# Altium project LPGDetA1.PrjPCB (part 1 of 2)
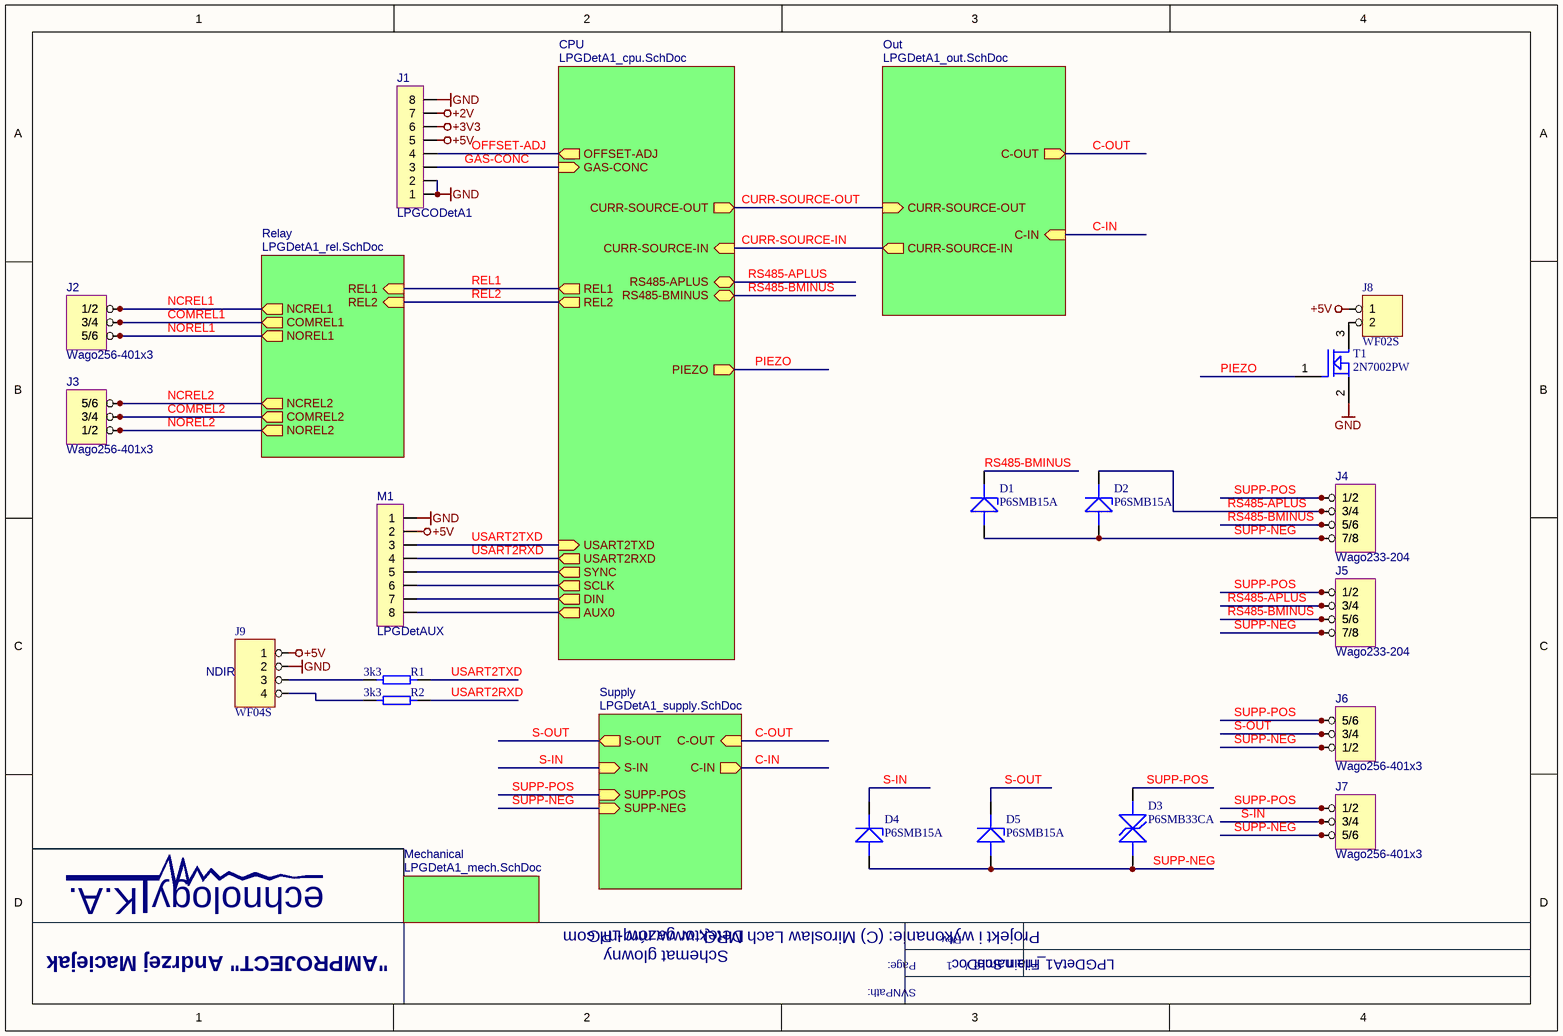
[diagram p0: LPGDetA1_main.SchDoc]
Nazwa_projektu: Detektor gazów LPG
6 sheets, 165 parts. Net scope: hierarchical (ports join the sheet entries above them; power ports are global).
Board files: LPGDetA1.PcbDoc, LPGDetA1_F.PcbDoc
Sheets:
  LPGDetA1_main.SchDoc
    CPU = LPGDetA1_cpu.SchDoc
    Supply = LPGDetA1_supply.SchDoc
    Out = LPGDetA1_out.SchDoc
    Mechanical = LPGDetA1_mech.SchDoc
    Relay = LPGDetA1_rel.SchDoc

## Sheet LPGDetA1_main.SchDoc
size A4; DocumentNumber: 1; SheetNumber: 1; SheetTotal: 6; Subtitle0: Schemat glowny; LotOfPieces: 1

### Parts
(Parts that share a designator on the sheet are numbered #1, #2 ... from top to bottom, then left to right.)
?#1  (no value)
D1  P6SMB15A  [SMB]
D2  P6SMB15A  [SMB]
D3  P6SMB33CA  [DO-214AA]
D4  P6SMB15A  [SMB]
D5  P6SMB15A  [SMB]
J1  LPGCODetA1  [LPGCODetA1]
J2  Wago256-401x3  [WAGO256-401x3]
J3  Wago256-401x3  [WAGO256-401x3]
J4  Wago233-204  [Wago233-204]
J5  Wago233-204  [Wago233-204]
J6  Wago256-401x3  [WAGO256-401x3]
J7  Wago256-401x3  [WAGO256-401x3]
J8  WF02S  [WF02S]
J9  WF04S  [WF04S]
M1  LPGDetAUX  [LPGDETAUX]
R1  OtherParams: 3k3  [0805]  (hidden comment: 0805WAJ 3K3 T5E)
R2  OtherParams: 3k3  [0805]  (hidden comment: 0805WAJ 3K3 T5E)
T1  2N7002PW  [SOT323-3_FLOW]

### Sub-sheets
CPU = LPGDetA1_cpu.SchDoc: OFFSET-ADJ, GAS-CONC, CURR-SOURCE-OUT, CURR-SOURCE-IN, RS485-APLUS, RS485-BMINUS, REL1, REL2, USART2TXD, USART2RXD, SYNC, SCLK, DIN, AUX0, PIEZO
Mechanical = LPGDetA1_mech.SchDoc: no entries
Out = LPGDetA1_out.SchDoc: CURR-SOURCE-OUT, C-OUT, C-IN, CURR-SOURCE-IN
Relay = LPGDetA1_rel.SchDoc: REL1, REL2, COMREL1, COMREL2, NOREL1, NOREL2, NCREL1, NCREL2
Supply = LPGDetA1_supply.SchDoc: SUPP-POS, SUPP-NEG, S-OUT, S-IN, C-IN, C-OUT

### Nets
+2V: J1.7
+3V3: J1.6
+5V: J1.5 J8.1 J9.1 M1.2
GND: J1.1 J1.2 J1.8 J9.2 M1.1 T1.2(SOURCE)
AUX0: M1.8 ; sheet CPU/AUX0
C-IN: sheet Supply/C-IN, sheet Out/C-IN
C-OUT: sheet Supply/C-OUT, sheet Out/C-OUT
COMREL1: J2.3(3/4) J2.4(3/4) ; sheet Relay/COMREL1
COMREL2: J3.3(3/4) J3.4(3/4) ; sheet Relay/COMREL2
CURR-SOURCE-IN: sheet CPU/CURR-SOURCE-IN, sheet Out/CURR-SOURCE-IN
CURR-SOURCE-OUT: sheet CPU/CURR-SOURCE-OUT, sheet Out/CURR-SOURCE-OUT
DIN: M1.7 ; sheet CPU/DIN
GAS-CONC: J1.3 ; sheet CPU/GAS-CONC
NCREL1: J2.1(1/2) J2.2(1/2) ; sheet Relay/NCREL1
NCREL2: J3.5(5/6) J3.6(5/6) ; sheet Relay/NCREL2
NOREL1: J2.5(5/6) J2.6(5/6) ; sheet Relay/NOREL1
NOREL2: J3.1(1/2) J3.2(1/2) ; sheet Relay/NOREL2
OFFSET-ADJ: J1.4 ; sheet CPU/OFFSET-ADJ
PIEZO: T1.1(GATE) ; sheet CPU/PIEZO
REL1: sheet CPU/REL1, sheet Relay/REL1
REL2: sheet CPU/REL2, sheet Relay/REL2
RS485-APLUS: D2.CATH J4.3(3/4) J4.4(3/4) J5.3(3/4) J5.4(3/4) ; sheet CPU/RS485-APLUS
RS485-BMINUS: D1.CATH J4.5(5/6) J4.6(5/6) J5.5(5/6) J5.6(5/6) ; sheet CPU/RS485-BMINUS
S-IN: D4.CATH J7.3(3/4) J7.4(3/4) ; sheet Supply/S-IN
S-OUT: D5.CATH J6.3(3/4) J6.4(3/4) ; sheet Supply/S-OUT
SCLK: M1.6 ; sheet CPU/SCLK
SUPP-NEG: D1.ANOD D2.ANOD D3.ANOD D4.ANOD D5.ANOD J4.7(7/8) J4.8(7/8) J5.7(7/8) J5.8(7/8) J6.1(1/2) J6.2(1/2) J7.5(5/6) J7.6(5/6) ; sheet Supply/SUPP-NEG
SUPP-POS: D3.CATH J4.1(1/2) J4.2(1/2) J5.1(1/2) J5.2(1/2) J6.5(5/6) J6.6(5/6) J7.1(1/2) J7.2(1/2) ; sheet Supply/SUPP-POS
SYNC: M1.5 ; sheet CPU/SYNC
USART2RXD: M1.4 R2.2 ; sheet CPU/USART2RXD
USART2TXD: M1.3 R1.2 ; sheet CPU/USART2TXD
NetJ8_2: J8.2 T1.3(DRAIN)
NetJ9_3: J9.3 R1.1
NetJ9_4: J9.4 R2.1

### Notes on the sheet
- (near J9) NDIR
- K.A.
- echnology
- Projekt i wykonanie: (C) Miroslaw Lach MRQ, www.mrq-ml.com
- "AMPROJECT" Andrzej Maciejak
- SVNPath:
- Page:
- Rev.
- /
- File name:

### Library data of the parts
?#1 = KATECHNOLOGYLOGO
D1 D2 D4 D5 = P6SMB15A[[/\]]SMB: Descript: Transient Suppresion Unidirectional Diode 15V 600W, case SMB; Reference5: P6SMB15A-LF; Currency5: PLZ; Amount5: 3+; Value: P6SMB15A; Dimensions: SMB; ComponentLink1Description: Datasheet; ComponentLink1URL: http://www.mrq-ml.com/Parts/Diodes/Littelfuse_TVS-Diodes_P6SMB.pdf; Supplier5: tme.pl; Manufacturer5: Littelfuse; Typ5: P6SMB15A; Price5: 0,7; DateOfPrice5: 2012-09-30; Price1: 0,48
D3 = P6SMB33CA[[/\]]SMB: Descript: Transient Suppresion Bidirectional Diode 40.7V 600W, case SMB; Currency5: PLN; Amount5: 3+; Value: P6SMB33CA; Dimensions: SMB; ComponentLink1Description: Datasheet; ComponentLink1URL: http://www.mrq-ml.com/Parts/Diodes/Littelfuse_TVS-Diodes_P6SMB.pdf; Supplier5: tme.pl; Reference5: P6SMB33CA; Manufacturer5: Semikron; Typ5: P6SMB33CA; Price5: 0,7; DateOfPrice5: 2012-11-24; Price1: 0,389
J1 = LPGCODetA1[[/\]]LPGCODetA1: Descript: Modul czujnika CO/LPG; Reference5: mlach; Value: LPGCODetA1; Dimensions: LPGCODetA1; Supplier5: modu³ LPGCODetA1
J2 J3 J6 J7 = Wago256-401x3[[/\]]15x15: Descript: z彻czka do p硑tek drukowanych 45� 2,5mm2 16A RM5 1P/2pin szary, 3 tory plus scianka; Reference5: 256-401 (3szt.) +256-100(1szt.); Typ5: 256-401x3, 256-100; Currency5: PLN; Amount5: 10+; Value: Wago256-401x3; Dimensions: 15x15; Supplier5: soselectronic.pl; Manufacturer5: Wago; Price5: 2,8278; DateOfPrice5: 2012-11-24; Price1: 2,3056
J4 J5 = Wago233-204[[/\]]13.9x12.3: Descript: PCB terminal strip with push buttons 0.5mm2; Currency5: PLN; Amount5: 2+; Value: Wago233-204; Dimensions: 13.9x12.3; ComponentLink1Description: Datasheet; ComponentLink1URL: http://www.mrq-ml.com/Parts/Connectors/Wago233-204.pdf; Supplier5: soselectronic.pl; Reference5: 233-204; Manufacturer5: Wago; Typ5: 233-204; Price5: 4,078; DateOfPrice5: 2012-11-24; Price1: 3,2542
J8 = WF02S[[/\]]WF02S: Descript: connector 2,54 pitch, SMD, 2 pole, straight, male; Reference5: WF02S-LF; Currency5: PLZ; Amount5: 10+; Value: WF02S; Dimensions: WF02S; ComponentLink1Description: Datasheet; ComponentLink1URL: http://www.mrq-ml.com/Parts/Connectors/WFXXS.pdf; Supplier5: maritex.com.pl; Price5: 0,029; DateOfPrice5: 2012-09-18
J9 = WF04S[[/\]]WF04S: Descript: connector 2.54mm pitch, THT, 4 pole, straight, male; Reference5: WF04S-JS; Currency5: PLN; Amount5: 10+; Value: WF04S; Dimensions: WF04S; ComponentLink1Description: Datasheet; ComponentLink1URL: http://www.mrq-ml.com/Parts/Connectors/WFXXS.pdf; Supplier5: maritex.com.pl; Price5: 0,069; DateOfPrice5: 2012-07-11
M1 = LPGDetAUX[[/\]]LPGDetAUX: Descript: Dodatkowy modul do LPGDet; Value: LPGDetAUX; Dimensions: LPGDetAUX
R1 R2 = 0805WAJ 3K3 T5E[[/\]]0805[[/\]]0.125W[[/\]]5%[[/\]]3k3: DissPower: 0.125W; Tolerance: 5%; Descript: Resistor 3.3kohm, 0.125W, 5%, 0805; Reference5: SMD0805-3K3; Currency5: PLN; Amount5: 100+; Value: 0805WAJ 3K3 T5E; Dimensions: 0805; ComponentLink1Description: Datasheet; ComponentLink1URL: http://www.mrq-ml.com/Parts/Resistors/RoyalOhm_rezystor-smd.pdf; Supplier5: tme.pl; Manufacturer5: Royal Ohm; Typ5: 0805WAJ 3K3 T5E; Price5: 0,025; DateOfPrice5: 2012-09-18
T1 = 2N7002PW[[/\]]SOT323-3: Descript: N-channel enhacement-mode vertical DMOS FET; Reference5: 1829184; Currency5: PLN; Amount5: 1+; Value: 2N7002PW; Dimensions: SOT323-3; ComponentLink1Description: Datasheet; ComponentLink1URL: http://www.mrq-ml.com/Parts/Transistors/2N7002PW.pdf; Supplier5: farnell.com; Manufacturer5: NXP; Typ5: 2N7002PW; Price5: 0,17; DateOfPrice5: 2012-09-19; Price1: 0,14

## Sheet LPGDetA1_cpu.SchDoc
size A4; DocumentNumber: 3; SheetNumber: 3; SheetTotal: 6; Subtitle0: Mikrokontoler; LotOfPieces: 1; SVNPath: SVNPath
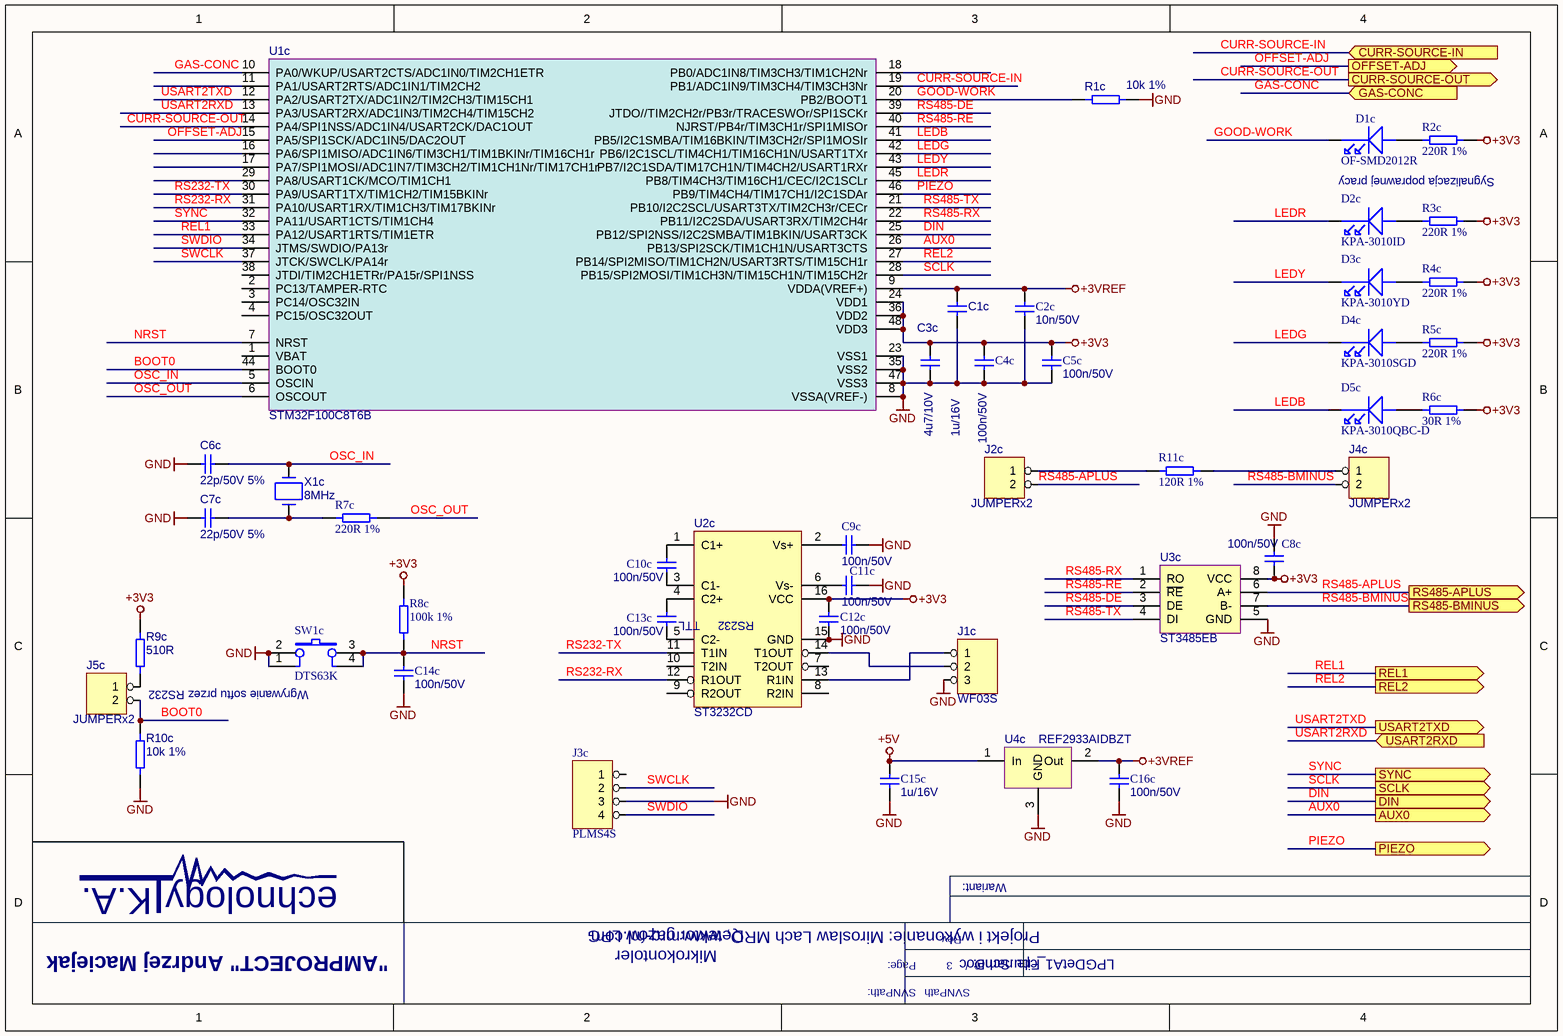
[diagram p1: LPGDetA1_cpu.SchDoc]

### Parts
(Parts that share a designator on the sheet are numbered #1, #2 ... from top to bottom, then left to right.)
?#2  (no value)
C1c  OtherParams: 1u/16V  [1206_0805]  (hidden comment: C0805C105K4RAC)
C2c  OtherParams: 10n/50V  [1206_0805]  (hidden comment: CL21B103KBANNNC)
C3c  OtherParams: 4u7/10V  [1206-IPC]  (hidden comment: CL31B475KPHNNNE)
C4c  OtherParams: 100n/50V  [1206_0805]  (hidden comment: CL21B104KBCNNNC)
C5c  OtherParams: 100n/50V  [1206_0805]  (hidden comment: CL21B104KBCNNNC)
C6c  OtherParams: 22p/50V 5%  [0805]  (hidden comment: CL21C220JBANNNC)
C7c  OtherParams: 22p/50V 5%  [0805]  (hidden comment: CL21C220JBANNNC)
C8c  OtherParams: 100n/50V  [1206_0805]  (hidden comment: CL21B104KBCNNNC)
C9c  OtherParams: 100n/50V  [1206_0805]  (hidden comment: CL21B104KBCNNNC)
C10c  OtherParams: 100n/50V  [1206_0805]  (hidden comment: CL21B104KBCNNNC)
C11c  OtherParams: 100n/50V  [1206_0805]  (hidden comment: CL21B104KBCNNNC)
C12c  OtherParams: 100n/50V  [1206_0805]  (hidden comment: CL21B104KBCNNNC)
C13c  OtherParams: 100n/50V  [1206_0805]  (hidden comment: CL21B104KBCNNNC)
C14c  OtherParams: 100n/50V  [1206_0805]  (hidden comment: CL21B104KBCNNNC)
C15c  OtherParams: 1u/16V  [1206_0805]  (hidden comment: C0805C105K4RAC)
C16c  OtherParams: 100n/50V  [1206_0805]  (hidden comment: CL21B104KBCNNNC)
D1c  OF-SMD2012R  [D0805]
D2c  KPA-3010ID  [KPA-3010SURCK]
D3c  KPA-3010YD  [KPA-3010SYCK]
D4c  KPA-3010SGD  [KPA-3010CGCK]
D5c  KPA-3010QBC-D  [KPA-3010QBC-D]
J1c  WF03S  [WF03S]
J2c  JUMPERx2  [2SIP100]
J3c  PLMS4S  [PLMS4S]
J4c  JUMPERx2  [2SIP100]
J5c  JUMPERx2  [2SIP100]
R1c  OtherParams: 10k 1%  [0805]  (hidden comment: 0805WAF10KT5E)
R2c  OtherParams: 220R 1%  [0805]  (hidden comment: 0805WAF 220R T5E)
R3c  OtherParams: 220R 1%  [0805]  (hidden comment: 0805WAF 220R T5E)
R4c  OtherParams: 220R 1%  [0805]  (hidden comment: 0805WAF 220R T5E)
R5c  OtherParams: 220R 1%  [0805]  (hidden comment: 0805WAF 220R T5E)
R6c  OtherParams: 30R 1%  [0805]  (hidden comment: 0805WAF 30R T5E)
R7c  OtherParams: 220R 1%  [0805]  (hidden comment: 0805WAF 220R T5E)
R8c  OtherParams: 100k 1%  [0805]  (hidden comment: 0805WAF 100K T5E)
R9c  OtherParams: 510R  [0805]  (hidden comment: 0805WAJ 510R T5E)
R10c  OtherParams: 10k 1%  [0805]  (hidden comment: 0805WAF10KT5E)
R11c  OtherParams: 120R 1%  [1206_0805]  (hidden comment: 0805WAF 120R T5E)
SW1c  DTS63K  [DTS63K]
U1c  STM32F100C8T6B  [MS-026ABC]
U2c  ST3232CD  [16SOIC150]
U3c  ST3485EB  [8SOIC150]
U4c  REF2933AIDBZT  [SOT23-3]
X1c  8MHz  [HXC-7SB]

### Ports
AUX0, CURR-SOURCE-IN, CURR-SOURCE-OUT, DIN, GAS-CONC, OFFSET-ADJ, PIEZO, REL1, REL2, RS485-APLUS, RS485-BMINUS, SCLK, SYNC, USART2RXD, USART2TXD

### Nets
+3V3: C3c.1 C4c.1 C5c.1 C8c.2 C12c.1 R2c.2 R3c.2 R4c.2 R5c.2 R6c.2 R8c.1 R9c.1 U1c.24(VDD1) U1c.36(VDD2) U1c.48(VDD3) U2c.16(VCC) U3c.8(VCC)
+3VREF: C1c.1 C2c.1 C16c.1 U1c.9(VDDA(VREF+)) U4c.2(Out)
+5V: C15c.1 U4c.1(In)
GND: C1c.2 C2c.2 C3c.2 C4c.2 C5c.2 C6c.1 C7c.1 C8c.1 C9c.2 C11c.2 C12c.2 C14c.2 C15c.2 C16c.2 J1c.3 J3c.3 R1c.2 R10c.1 SW1c.1 SW1c.2 U1c.8(VSSA(VREF-)) U1c.23(VSS1) U1c.35(VSS2) U1c.47(VSS3) U2c.15(GND) U3c.5(GND) U4c.3(GND)
AUX0: U1c.26(PB13/SPI2SCK/TIM1CH1N/USART3CTS) ; port AUX0
BOOT0: J5c.2 R10c.2 U1c.44(BOOT0)
CURR-SOURCE-IN: U1c.19(PB1/ADC1IN9/TIM3CH4/TIM3CH3Nr) ; port CURR-SOURCE-IN
CURR-SOURCE-OUT: U1c.14(PA4/SPI1NSS/ADC1IN4/USART2CK/DAC1OUT) ; port CURR-SOURCE-OUT
DIN: U1c.25(PB12/SPI2NSS/I2C2SMBA/TIM1BKIN/USART3CK) ; port DIN
GAS-CONC: U1c.10(PA0/WKUP/USART2CTS/ADC1IN0/TIM2CH1ETR) ; port GAS-CONC
GOOD-WORK: D1c.CATH R1c.1 U1c.20(PB2/BOOT1)
LEDB: D5c.CATH U1c.41(PB5/I2C1SMBA/TIM16BKIN/TIM3CH2r/SPI1MOSIr)
LEDG: D4c.CATH U1c.42(PB6/I2C1SCL/TIM4CH1/TIM16CH1N/USART1TXr)
LEDR: D2c.CATH U1c.45(PB8/TIM4CH3/TIM16CH1/CEC/I2C1SCLr)
LEDY: D3c.CATH U1c.43(PB7/I2C1SDA/TIM17CH1N/TIM4CH2/USART1RXr)
NRST: C14c.1 R8c.2 SW1c.3 SW1c.4 U1c.7(NRST)
OFFSET-ADJ: U1c.15(PA5/SPI1SCK/ADC1IN5/DAC2OUT) ; port OFFSET-ADJ
OSC_IN: C6c.2 U1c.5(OSCIN) X1c.1
OSC_OUT: R7c.2 U1c.6(OSCOUT)
PIEZO: U1c.46(PB9/TIM4CH4/TIM17CH1/I2C1SDAr) ; port PIEZO
REL1: U1c.33(PA12/USART1RTS/TIM1ETR) ; port REL1
REL2: U1c.27(PB14/SPI2MISO/TIM1CH2N/USART3RTS/TIM15CH1r) ; port REL2
RS232-RX: U1c.31(PA10/USART1RX/TIM1CH3/TIM17BKINr) U2c.12(R1OUT)
RS232-TX: U1c.30(PA9/USART1TX/TIM1CH2/TIM15BKINr) U2c.11(T1IN)
RS485-APLUS: J2c.2 U3c.6(A+) ; port RS485-APLUS
RS485-BMINUS: J4c.2 U3c.7(B-) ; port RS485-BMINUS
RS485-DE: U1c.39(JTDO//TIM2CH2r/PB3r/TRACESWOr/SPI1SCKr) U3c.3(DE)
RS485-RE: U1c.40(NJRST/PB4r/TIM3CH1r/SPI1MISOr) U3c.2(~{RE})
RS485-RX: U1c.22(PB11/I2C2SDA/USART3RX/TIM2CH4r) U3c.1(RO)
RS485-TX: U1c.21(PB10/I2C2SCL/USART3TX/TIM2CH3r/CECr) U3c.4(DI)
SCLK: U1c.28(PB15/SPI2MOSI/TIM1CH3N/TIM15CH1N/TIM15CH2r) ; port SCLK
SWCLK: J3c.2 U1c.37(JTCK/SWCLK/PA14r)
SWDIO: J3c.4 U1c.34(JTMS/SWDIO/PA13r)
SYNC: U1c.32(PA11/USART1CTS/TIM1CH4) ; port SYNC
USART2RXD: U1c.13(PA3/USART2RX/ADC1IN3/TIM2CH4/TIM15CH2) ; port USART2RXD
USART2TXD: U1c.12(PA2/USART2TX/ADC1IN2/TIM2CH3/TIM15CH1) ; port USART2TXD
NetC7c_2: C7c.2 R7c.1 X1c.2
NetC9c_1: C9c.1 U2c.2(Vs+)
NetC10c_1: C10c.1 U2c.1(C1+)
NetC10c_2: C10c.2 U2c.3(C1-)
NetC11c_1: C11c.1 U2c.6(Vs-)
NetC13c_1: C13c.1 U2c.4(C2+)
NetC13c_2: C13c.2 U2c.5(C2-)
NetD1c_ANOD: D1c.ANOD R2c.1
NetD2c_ANOD: D2c.ANOD R3c.1
NetD3c_ANOD: D3c.ANOD R4c.1
NetD4c_ANOD: D4c.ANOD R5c.1
NetD5c_ANOD: D5c.ANOD R6c.1
NetJ1c_1: J1c.1 U2c.13(R1IN)
NetJ1c_2: J1c.2 U2c.14(T1OUT)
NetJ2c_1: J2c.1 R11c.1
NetJ4c_1: J4c.1 R11c.2
NetJ5c_1: J5c.1 R9c.2

Not connected (* = marked no-connect by the designer): J3c 1; U1c 1(VBAT) 2(PC13/TAMPER-RTC) 3(PC14/OSC32IN) 4(PC15/OSC32OUT) 11(PA1/USART2RTS/ADC1IN1/TIM2CH2) 16(PA6/SPI1MISO/ADC1IN6/TIM3CH1/TIM1BKINr/TIM16CH1r) 17(PA7/SPI1MOSI/ADC1IN7/TIM3CH2/TIM1CH1Nr/TIM17CH1r) 18(PB0/ADC1IN8/TIM3CH3/TIM1CH2Nr) 29(PA8/USART1CK/MCO/TIM1CH1) 38(JTDI/TIM2CH1ETRr/PA15r/SPI1NSS); U2c 7(T2OUT) 8(R2IN) 9(R2OUT) 10(T2IN)

### Notes on the sheet
- Sygnalizacja poprawnej pracy
- Wgrywanie softu przez RS232
- K.A.
- echnology
- Wariant:
- Projekt i wykonanie: Miroslaw Lach MRQ, www.mrq-ml.com
- "AMPROJECT" Andrzej Maciejak
- SVNPath:
- Page:
- Rev.
- /
- File name:
- (in symbol ST3232CD[[/\]]16SOIC150) TTL; RS232

### Library data of the parts
?#2 = KATECHNOLOGYLOGO
C1c = C0805C105K4RAC[[/\]]0805[[/\]]16V[[/\]]10%[[/\]]1u/16V: Manufacturer1: KEMET; MaxVoltage: 16V; Tolerance: 10%; Tmin: -55; Tmax: +125; Descript: capacitor 1uF, 16V, 0805, 10%, X7R; Currency1: PLZ; Amount1: 10000+; Currency5: PLN; Amount5: 100+; Value: C0805C105K4RAC; Supplier1: tme.pl; Reference1: C0805C105K4RAC; Price1: 0,099; Typ1: C0805C105K4RAC; Dimensions: 0805; ComponentLink1Description: Datasheet; ComponentLink1URL: http://www.mrq-ml.com/Parts/Capacitors/ceramic_chip_kemet.pdf; DateOfPrice1: 2010-03-06; Supplier5: tme.pl; Reference5: C0805C105K4RAC; Manufacturer5: KEMET; Typ5: C0805C105K4RAC; Price5: 0,099; DateOfPrice5: 2013-01-03
C2c = CL21B103KBANNNC[[/\]]0805[[/\]]50V[[/\]]10%[[/\]]10n/50V: MaxVoltage: 50V; Tolerance: 10%; Descript: capacitor 10nF/50V, 0805, X7R, 10%; Currency5: PLN; Amount5: 100+; Value: CL21B103KBANNNC; Dimensions: 0805; ComponentLink1Description: Datasheet; ComponentLink1URL: http://www.mrq-ml.com/Parts/Capacitors/mlcc_samsung.pdf; Supplier5: tme.pl; Reference5: CL21B103KBANNNC; Manufacturer5: Samsung; Typ5: CL21B103KBANNNC; Price5: 0,029; DateOfPrice5: 2012-09-19; Price1: 0,013
C3c = CL31B475KPHNNNE[[/\]]1206[[/\]]10V[[/\]]10%[[/\]]4u7/10V: Manufacturer1: Samsung; MaxVoltage: 10V; Tolerance: 10%; Tmin: -55; Tmax: +125; Descript: capacitor 4.7uF, 10V, X7R, 10%, 1206; Currency1: PLN; Amount1: 12000+; Amount5: 100+; Value: CL31B475KPHNNNE; Supplier1: tme.pl; Reference1: CL31B475KPHNNNE; Typ1: CL31B475KPHNNNE; Dimensions: 1206; ComponentLink1Description: Datasheet; ComponentLink1URL: http://www.mrq-ml.com/Parts/Capacitors/mlcc_samsung.pdf; DateOfPrice1: 2010-09-07; Supplier5: tme.pl; Reference5: CL31B475KPHNNNE; Manufacturer5: Samsung; Typ5: CL31B475KPHNNNE; Price5: 0,179; Currency5: PLN; DateOfPrice5: 2012-11-24; Price1: 0,179
C4c C5c C8c C9c C10c C11c C12c C13c C14c C16c = CL21B104KBCNNNC[[/\]]0805[[/\]]50V[[/\]]10%[[/\]]100n/50V: MaxVoltage: 50V; Tolerance: 10%; Descript: capacitor 100nF/50V, 0805, X7R, 10%; Currency5: PLN; Amount5: 100+; Value: CL21B104KBCNNNC; Price1: 0,019; Dimensions: 0805; ComponentLink1Description: Datasheet; ComponentLink1URL: http://www.mrq-ml.com/Parts/Capacitors/mlcc_samsung.pdf; Supplier5: tme.pl; Reference5: CL21B104KBCNNNC; Manufacturer5: Samsung; Typ5: CL21B104KBCNNNC; Price5: 0,025; DateOfPrice5: 2013-01-03
C6c C7c = CL21C220JBANNNC[[/\]]0805[[/\]]50V[[/\]]5%[[/\]]22p/50V 5%: Manufacturer1: Samsung; Amount2: 4000+; MaxVoltage: 50V; Tolerance: 5%; Tmin: -55; Tmax: +125; Descript: capacitor 22pF, 50V, COG 5%; Currency1: PLZ; Amount1: 12000+; Currency5: PLN; Amount5: 100+; Value: CL21C220JBANNNC; Supplier1: tme.pl; Reference1: CL21C220JBANNNC; Price1: 0,018; Price2: 0,012; Reference2: CL21C220JBANNNC; Supplier2: tme.pl; Typ1: CL21C220JBANNNC; Manufacturer2: Samsung; Dimensions: 0805; ComponentLink1Description: Datasheet; ComponentLink1URL: http://www.mrq-ml.com/Parts/Capacitors/mlcc_samsung.pdf; DateOfPrice1: 2010-04-07; Typ2: CL21C220JBANNNC; Currency2: PLZ; DateOfPrice2: 2009-08-16; Supplier5: tme.pl; Reference5: CL21C220JBANNNC; Manufacturer5: Samsung; Typ5: CL21C220JBANNNC; Price5: 0,029; DateOfPrice5: 2012-09-19
C15c = C0805C105K4RAC[[/\]]0805[[/\]]16V[[/\]]10%[[/\]]1u/16V: MaxVoltage: 16V; Tolerance: 10%; Descript: capacitor 1uF, 16V, 0805, 10%, X7R; Currency5: PLN; Amount5: 100+; Value: C0805C105K4RAC; Dimensions: 0805; ComponentLink1Description: Datasheet; ComponentLink1URL: http://www.mrq-ml.com/Parts/Capacitors/ceramic_chip_kemet.pdf; Supplier5: tme.pl; Reference5: C0805C105K4RAC; Manufacturer5: KEMET; Typ5: C0805C105K4RAC; Price5: 0,099; DateOfPrice5: 2013-01-03; Price1: 0,099
D1c = OF-SMD2012R[[/\]]D0805: Descript: LED; SMD; 0805; czerwony; 90-120mcd; 120°; Currency5: PLZ; Amount5: 10+; Value: OF-SMD2012R; Dimensions: D0805; ComponentLink1Description: Datasheet; ComponentLink1URL: http://www.mrq-ml.com/Parts/Diodes/of-smd2012r.pdf; Supplier5: tme.pl; Reference5: OF-SMD2012R; Manufacturer5: Optoflash; Typ5: OF-SMD2012R; Price5: 0,21; DateOfPrice5: 2012-11-24; Price1: 0,14
D2c = KPA-3010ID[[/\]]KPA-3010ID: Descript: 3.0x1.0mm Right angle smd chip led lamp red; Currency5: PLN; Amount5: 10+; Value: KPA-3010ID; Dimensions: KPA-3010ID; ComponentLink1Description: Datasheet; ComponentLink1URL: http://www.mrq-ml.com/Parts/Diodes/kp-3010id.pdf; Supplier5: tme.pl; Reference5: KPA-3010ID; Manufacturer5: Kingbright Electronic; Typ5: KPA-3010ID; Price5: 0,339; DateOfPrice5: 2013-01-12; Price1: 0,287
D3c = KPA-3010YD[[/\]]KPA-3010YD: Descript: 3.0x1.0mm Right angle smd chip led lamp yellow; Currency5: PLN; Amount5: 10+; Value: KPA-3010YD; Dimensions: KPA-3010YD; ComponentLink1Description: Datasheet; ComponentLink1URL: http://www.mrq-ml.com/Parts/Diodes/kpa-3010.pdf; Supplier5: tme.pl; Reference5: KPA-3010YD; Manufacturer5: Kingbright Electronic; Typ5: KPA-3010YD; Price5: 0,383; DateOfPrice5: 2013-01-12; Price1: 0,326
D4c = KPA-3010SGD[[/\]]KPA-3010SGD: Descript: 3.0x1.0mm Right angle smd chip led lamp green; Currency5: PLN; Amount5: 10+; Value: KPA-3010SGD; Dimensions: KPA-3010SGD; ComponentLink1Description: Datasheet; ComponentLink1URL: http://www.mrq-ml.com/Parts/Diodes/kpa-3010.pdf; Supplier5: tme.pl; Reference5: KPA-3010SGD; Manufacturer5: Kingbright Electronic; Typ5: KPA-3010SGD; Price5: 0,354; DateOfPrice5: 2013-01-12; Price1: 0,275
D5c = KPA-3010QBC-D[[/\]]KPA-3010QBC-D: Descript: 3.0x1.0mm Right angle smd chip led lamp blue; Reference5: 2146443; Currency5: PLN; Amount5: 1+; Value: KPA-3010QBC-D; Dimensions: KPA-3010QBC-D; ComponentLink1Description: Datasheet; ComponentLink1URL: http://www.mrq-ml.com/Parts/Diodes/KPA-3010QBC-D.pdf; Supplier5: farnell.com; Manufacturer5: Kingbright Electronic; Typ5: KPA-3010QBC-D; Price5: 0,87; DateOfPrice5: 2012-12-10; Price1: 0,7
J1c = WF03S[[/\]]WF03S: Descript: connector 2,54mm pitch, THT, 3 pole, stright; Reference1: WF03S-LF; Currency1: PLN; Amount1: 5000+; Reference5: WF03S-JS; Amount5: 10+; Value: WF03S; Dimensions: WF03S; ComponentLink1Description: Datasheet; ComponentLink1URL: http://www.mrq-ml.com/Parts/Connectors/WFXXS.pdf; Supplier1: maritex.com.pl; DateOfPrice1: 2010-03-06; Supplier5: maritex.com.pl; Price5: 0,055; Currency5: PLN; DateOfPrice5: 2012-11-24; Price1: 0,0550
J2c J4c J5c = JUMPERx2[[/\]]2.54mm: Descript: pin header 2 pin, 1/40 of PLD80S; Reference1: PLD80S-2; Currency1: PLN; Amount1: 80000+; Currency2: PLZ; Amount2: 40000+; Amount3: 9600+; Amount4: 1600+; Amount5: 20+; Value: JUMPERx2; Dimensions: 2.54mm; Supplier1: maritex.com.pl; DateOfPrice1: 2010-03-13; Supplier2: maritex.com.pl; Reference2: PLD80S-2; Price2: 0,01425; DateOfPrice2: 2009-11-24; Supplier3: maritex.com.pl; Reference3: PLD80S-2; Price3: 0,015; Currency3: PLZ; DateOfPrice3: 2009-11-24; Supplier4: maritex.com.pl; Reference4: PLD80S-2; Price4: 0,01575; Currency4: PLZ; DateOfPrice4: 2009-11-24; Supplier5: maritex.com.pl; Reference5: PLD80S-2; Price5: 0,0645; Currency5: PLN; DateOfPrice5: 2012-11-24; Price1: 0,0645
J3c = PLMS4S[[/\]]4x2mm: Descript: connector 2.00mm pitch, 4 poles, one row; Reference1: PLMS40S-LF*4/40; Currency1: PLN; Amount1: 500+; Reference5: PLMS40S-LF; Amount5: 1+; Value: PLMS4S; Dimensions: 4x2mm; ComponentLink1Description: Datasheet; ComponentLink1URL: http://www.mrq-ml.com/Parts/Connectors/plms40s-lf.pdf; Supplier1: maritex.com.pl; DateOfPrice1: 2010-11-19; Supplier5: maritex.com.pl; Price5: 0,085; Currency5: PLN; DateOfPrice5: 2012-11-24; Price1: 0,0850
R1c R10c = 0805WAF10KT5E[[/\]]0805[[/\]]0.125W[[/\]]1%[[/\]]10k 1%: Manufacturer1: Royal Ohm; Reference1: SMD0805 10K 1%; Amount1: 50000+; Amount2: 15000+; DissPower: 0.125W; Tolerance: 1%; Tmin: -55; Tmax: +155; Descript: Resistor 10kohm, 0805, 1%; Currency1: PLN; Currency2: PLZ; Amount4: 1000+; Reference5: SMD0805-10K-1%; Amount5: 100+; Value: 0805WAF10KT5E; Price2: 0,007; Reference2: SMD0805 10K 1%; Supplier1: tme.pl; Supplier2: tme.pl; Typ1: 0805WAF 10K T5E; Manufacturer2: Royal Ohm; Typ2: 0805WAF 10K T5E; Dimensions: 0805; ComponentLink1Description: Datasheet; ComponentLink1URL: http://www.mrq-ml.com/Parts/Resistors/RoyalOhm_rezystor-smd.pdf; DateOfPrice1: 2010-02-01; DateOfPrice2: 2009-10-20; Supplier4: tme.pl; Reference4: SMD0805 10K 1%; Manufacturer4: Royal Ohm; Typ4: 0805WAF 10K T5E; Price4: 0,019; Currency4: PLZ; DateOfPrice4: 2009-10-20; Supplier5: tme.pl; Manufacturer5: Royal Ohm; Typ5: 0805WAF 10K T5E; Price5: 0,029; Currency5: PLN; DateOfPrice5: 2013-01-03; Price1: 0,018
R2c R3c R4c R5c R7c = 0805WAF 220R T5E[[/\]]0805[[/\]]0.125W[[/\]]1%[[/\]]220R 1%: Manufacturer1: Royal Ohm; Reference1: SMD0805-220R-1%; Amount1: 50000+; DissPower: 0.125W; Tolerance: 1%; Descript: Resistor 220ohm, 0805, 1%; Currency1: PLN; Amount5: 100+; Value: 0805WAF 220R T5E; Supplier1: tme.pl; Typ1: 0805WAF 220R T5E; Dimensions: 0805; ComponentLink1Description: Datasheet; ComponentLink1URL: http://www.mrq-ml.com/Parts/Resistors/RoyalOhm_rezystor-smd.pdf; DateOfPrice1: 2012-01-30; Supplier5: tme.pl; Reference5: SMD0805-220R-1%; Manufacturer5: Royal Ohm; Typ5: 0805WAF 220R T5E; Price5: 0,029; Currency5: PLN; DateOfPrice5: 2012-09-19; Price1: 0,018
R6c = 0805WAF 30R T5E[[/\]]0805[[/\]]0.125W[[/\]]1%[[/\]]30R 1%: DissPower: 0.125W; Tolerance: 1%; Descript: Resistor 30ohm, 0805, 1%; Reference5: SMD0805-30R-1%; Currency5: PLN; Amount5: 100+; Value: 0805WAF 30R T5E; Dimensions: 0805; ComponentLink1Description: Datasheet; ComponentLink1URL: http://www.mrq-ml.com/Parts/Resistors/RoyalOhm_rezystor-smd.pdf; Supplier5: tme.pl; Manufacturer5: Royal Ohm; Typ5: 0805WAF 30R T5E; Price5: 0,029; DateOfPrice5: 2012-11-24; Price1: 0,029
R8c = 0805WAF 100K T5E[[/\]]0805[[/\]]0.125W[[/\]]1%[[/\]]100k 1%: Descript: Resistor 100kohm, 0805, 1%; DissPower: 0.125W; Tolerance: 1%; Reference5: SMD0805-100K-1%; Currency5: PLN; Amount5: 100+; Value: 0805WAF 100K T5E; Dimensions: 0805; ComponentLink1Description: Datasheet; ComponentLink1URL: http://www.mrq-ml.com/Parts/Resistors/RoyalOhm_rezystor-smd.pdf; Supplier5: tme.pl; Manufacturer5: Royal Ohm; Typ5: 0805WAF 100K T5E; Price5: 0,029; DateOfPrice5: 2012-09-20; Price1: 0,017
R9c = 0805WAJ 510R T5E[[/\]]0805[[/\]]0.125W[[/\]]5%[[/\]]510R: Manufacturer1: Royal Ohm; Reference1: SMD0805 510R; Amount1: 50000+; Amount2: 15000+; DissPower: 0.125W; Tolerance: 5%; Tmin: -55; Tmax: +155; Descript: Resistor 510 ohm, 0805, 5%; Currency1: PLN; Currency2: PLZ; Amount4: 1000+; Reference5: SMD0805-510R; Amount5: 100+; Value: 0805WAJ 510R T5E; Supplier1: tme.pl; Price2: 0,004; Reference2: SMD0805 510R; Supplier2: tme.pl; Typ1: 0805WAJ 510R T5E; Manufacturer2: Royal Ohm; Typ2: 0805WAJ 510R T5E; Dimensions: 0805; ComponentLink1Description: Datasheet; ComponentLink1URL: http://www.mrq-ml.com/Parts/Resistors/RoyalOhm_rezystor-smd.pdf; DateOfPrice1: 2010-02-03; DateOfPrice2: 2009-10-06; Supplier4: tme.pl; Reference4: SMD0805 510R; Manufacturer4: Royal Ohm; Typ4: 0805WAJ 510R T5E; Price4: 0,013; Currency4: PLZ; DateOfPrice4: 2009-10-06; Supplier5: tme.pl; Manufacturer5: Royal Ohm; Typ5: 0805WAJ 510R T5E; Price5: 0,025; Currency5: PLN; DateOfPrice5: 2012-11-24; Price1: 0,025
R11c = 0805WAF 120R T5E[[/\]]0805[[/\]]0.125W[[/\]]1%[[/\]]120R 1%: DissPower: 0.125W; Tolerance: 1%; Descript: Resistor 120ohm, 0805, 1%; Reference5: SMD0805-120R-1%; Currency5: PLN; Amount5: 100+; Value: 0805WAF 120R T5E; Dimensions: 0805; ComponentLink1Description: Datasheet; ComponentLink1URL: http://www.mrq-ml.com/Parts/Resistors/RoyalOhm_rezystor-smd.pdf; Supplier5: tme.pl; Manufacturer5: Royal Ohm; Typ5: 0805WAF 120R T5E; Price5: 0,029; DateOfPrice5: 2012-11-24; Price1: 0,029
SW1c = DTS63K[[/\]]DTS63K[[/\]]6x6: Descript: tactile switch; Currency5: PLN; Amount5: 5+; Typ5: DTS-63K; Value: DTS63K; Dimensions: 6x6; ComponentLink1Description: Datasheet; ComponentLink1URL: http://www.mrq-ml.com/Parts/Electromechanical/DTSxA62x6xx644.pdf; Supplier5: tme.pl; Reference5: DTS63K; Manufacturer5: Diptronics; Price5: 0,5655; DateOfPrice5: 2012-09-21; OtherParams: DTS63K
U1c = STM32F100C8T6B[[/\]]MS-026ABC: Manufacturer1: ST; Reference1: 1838511; Amount1: 100+; Tmin: -40; Tmax: +85; Descript: MCU, 32BIT, CORTEXM3, 64K FLASH, 48LQFP; Currency1: PLN; Amount5: 1+; Value: STM32F100C8T6B; Supplier1: farnell.com; Dimensions: MS-026ABC; ComponentLink1Description: Datasheet; ComponentLink1URL: http://www.mrq-ml.com/Parts/ICs/STM32F103xC_D_E.pdf; Typ1: STM32F100C8T6B; DateOfPrice1: 2012-01-26; Supplier5: kamami.pl; Reference5: STM32F100C8T6B; Manufacturer5: ST; Typ5: STM32F100C8T6B; Price5: 10,87; Currency5: PLN; DateOfPrice5: 2012-11-24; Price1: 9,51
U2c = ST3232CD[[/\]]16SOIC150: DUAL EIA-232 DRIVER/RECEIVER; Manufacturer1: ST; Amount1: 100+; Amount2: 25+; Amount4: 3+; Tmin: 0; Tmax: 70; Descript: DUAL EIA-232 DRIVER/RECEIVER, 3-5V; Currency1: PLN; Currency2: PLZ; Amount5: 1+; Value: ST3232CD; Price2: 2,41; Reference1: ST3232CD; Reference2: ST3232CD; Supplier1: tme.pl; Supplier2: tme.pl; Manufacturer2: ST; Supplier4: tme.pl; Reference4: ST3232CD; Manufacturer4: ST; Price4: 3,09; Dimensions: 16SOIC150; ComponentLink1Description: Datasheet; ComponentLink1URL: http://www.mrq-ml.com/Parts/ICs/ST3232.pdf; Typ1: ST3232CD; DateOfPrice1: 2010-03-06; Typ2: ST3232CD; DateOfPrice2: 2009-11-15; Typ4: ST3232CD; Currency4: PLZ; DateOfPrice4: 2009-11-15; Supplier5: tme.pl; Reference5: ST3232CD; Manufacturer5: ST; Typ5: ST3232CD; Price5: 2,65; Currency5: PLN; DateOfPrice5: 2012-11-24; Price1: 2,03
U3c = ST3485EB[[/\]]8SOIC150: Descript: 3.3V powered, 15kV ESD protected, up to 12Mbps RS485/RS422 transceiver; Reference5: ST3485EBD; Currency5: PLN; Amount5: 1+; Value: ST3485EB; Dimensions: 8SOIC150; ComponentLink1Description: Datasheet; ComponentLink1URL: http://www.mrq-ml.com/Parts/ICs/ST3485.pdf; Supplier5: tme.pl; Manufacturer5: ST; Typ5: ST3485EBD; Price5: 4,41; DateOfPrice5: 2012-11-24; Price1: 3,05
U4c = REF2933AIDBZT[[/\]]SOT23-3: Descript: 100ppm/°C, 50µA in SOT23-3 CMOS VOLTAGE REFERENCE; Reference5: 1459250; Currency5: PLN; Amount5: 1+; Value: REF2933AIDBZT; Price1: 6,11; Dimensions: SOT23-3; ComponentLink1Description: Datasheet; ComponentLink1URL: http://www.mrq-ml.com/Parts/ICs/REF29xx.pdf; Supplier5: farnell.com; Manufacturer5: Texas Instruments; Typ5: REF2933AIDBZT; Price5: 8,82; DateOfPrice5: 2012-11-15
X1c = 12SMX (B) 30/5020/16 8.0 MHZ[[/\]]HC49SMP[[/\]]8MHz: Manufacturer1: IQD Frequency Products; Reference1: 1276690; Descript: oscillator 8MHz, 5x7mm; Currency1: PLN; Amount1: 100+; Amount5: 1+; Value: 12SMX (B) 30/5020/16 8.0 MHZ; OtherParams: 8MHz; Supplier1: farnell.com; Dimensions: HC49SMP; Price1: 3,6100; DateOfPrice1: 2011-12-01; Supplier5: farnell.com; Reference5: 1276690; Price5: 4,78; Currency5: PLN; DateOfPrice5: 2012-11-03; ComponentLink1URL: oscillator 8MHz, 5x7mm; Typ1: 12SMX (B) 30/5020/16 8.0 MHZ; Manufacturer5: IQD Frequency Products; Typ5: 12SMX (B) 30/5020/16 8.0 MHZ; Price11: 3,5100

## Sheet LPGDetA1_supply.SchDoc
size A4; DocumentNumber: 4; SheetNumber: 4; SheetTotal: 6; Subtitle0: Zasilanie; LotOfPieces: 1; SVNPath: SVNPath
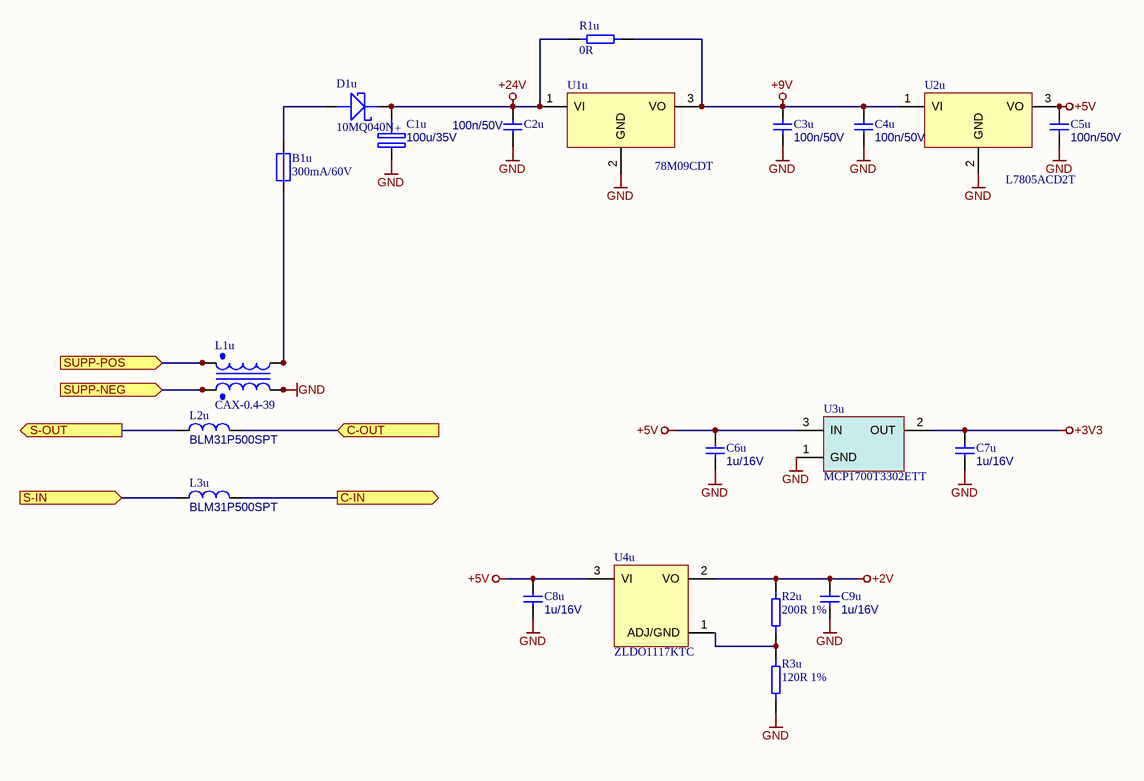
[diagram p2: LPGDetA1_supply.SchDoc]

### Parts
(Parts that share a designator on the sheet are numbered #1, #2 ... from top to bottom, then left to right.)
?#3  (no value)
B1u  OtherParams: 300mA/60V  [2920]  (hidden comment: SL030-60)
C1u  OtherParams: 100u/35V  [CE1028]  (hidden comment: SD1V107M6L011BB)
C2u  OtherParams: 100n/50V  [1206_0805]  (hidden comment: CL21B104KBCNNNC)
C3u  OtherParams: 100n/50V  [1206_0805]  (hidden comment: CL21B104KBCNNNC)
C4u  OtherParams: 100n/50V  [1206_0805]  (hidden comment: CL21B104KBCNNNC)
C5u  OtherParams: 100n/50V  [1206_0805]  (hidden comment: CL21B104KBCNNNC)
C6u  OtherParams: 1u/16V  [1206_0805]  (hidden comment: C0805C105K4RAC)
C7u  OtherParams: 1u/16V  [1206_0805]  (hidden comment: C0805C105K4RAC)
C8u  OtherParams: 1u/16V  [0805]  (hidden comment: C0805C105K4RAC)
C9u  OtherParams: 1u/16V  [1206_0805]  (hidden comment: C0805C105K4RAC)
D1u  10MQ040N  [SMA]
L1u  CAX-0.4-39  [IND_CAX_V]
L2u  BLM31P500SPT  [1206]
L3u  BLM31P500SPT  [1206]
R1u  OtherParams: 0R  [1206_0805]  (hidden comment: 0805WAJ 0R T5E)
R2u  OtherParams: 200R 1%  [0805]  (hidden comment: 0805WAF 200R T5E)
R3u  OtherParams: 120R 1%  [1206_0805]  (hidden comment: 0805WAF 120R T5E)
U1u  78M09CDT  [TO-252]
U2u  L7805ACD2T  [D2PAK]
U3u  MCP1700T3302ETT  [SOT23-3]
U4u  ZLDO1117KTC  [TO-252]

### Ports
C-IN, C-OUT, S-IN, S-OUT, SUPP-NEG, SUPP-POS

### Nets
+2V: C9u.1 R2u.1 U4u.2(VO)
+3V3: C7u.1 U3u.2(OUT)
+5V: C5u.1 C6u.1 C8u.1 U2u.3(VO) U3u.3(IN) U4u.3(VI)
+9V: C3u.1 C4u.1 R1u.2 U1u.3(VO) U2u.1(VI)
+24V: C1u.2 C2u.1 D1u.CATH R1u.1 U1u.1(VI)
GND: C1u.1 C2u.2 C3u.2 C4u.2 C5u.2 C6u.2 C7u.2 C8u.2 C9u.2 L1u.5(OUT2) L1u.6(OUT2) R3u.2 U1u.2(GND) U2u.2(GND) U3u.1(GND)
C-IN: L3u.2 ; port C-IN
C-OUT: L2u.2 ; port C-OUT
S-IN: L3u.1 ; port S-IN
S-OUT: L2u.1 ; port S-OUT
SUPP-NEG: L1u.3(IN2) L1u.4(IN2) ; port SUPP-NEG
SUPP-POS: L1u.1(IN1) L1u.2(IN1) ; port SUPP-POS
NetB1u_1: B1u.1 D1u.ANOD
NetB1u_2: B1u.2 L1u.7(OUT1) L1u.8(OUT1)
NetR2u_2: R2u.2 R3u.1 U4u.1(ADJ/GND)

### Notes on the sheet
- K.A.
- echnology
- Wariant:
- Projekt i wykonanie: Miroslaw Lach MRQ, www.mrq-ml.com
- "AMPROJECT" Andrzej Maciejak
- SVNPath:
- Page:
- Rev.
- /
- File name:
- (in symbol SD1V107M6L011BB[[/\]]CE1028[[/\]]35V[[/\]]20%[[/\]]100u/35V) +

### Library data of the parts
?#3 = KATECHNOLOGYLOGO
B1u = 300mA/60V[[/\]]SL030-60[[/\]]2920: Descript: SMD polymer fuse 300mA, 60VDC; Typ5: SL030; Amount5: 10+; Currency5: PLN; Value: SL030-60; Dimensions: 2920; ComponentLink1Description: Datasheet; ComponentLink1URL: http://www.mrq-ml.com/Parts/Electromechanical/K1008322279.pdf; Supplier5: tme.pl; Reference5: SL030-60; Manufacturer5: ECE; DateOfPrice5: 2012-11-24; Price1: 0,51; Price5: 0,58
C1u = SD1V107M6L011BB[[/\]]CE1028[[/\]]35V[[/\]]20%[[/\]]100u/35V: MaxVoltage: 35V; Tolerance: 20%; Descript: capacitor 100uF, 35V, low impedance, fi 6.3mmx11mm; Currency5: PLN; Amount5: 25+; Value: SD1V107M6L011BB; Dimensions: CE1028; ComponentLink1Description: Datasheet; ComponentLink1URL: http://www.mrq-ml.com/Parts/Capacitors/Samwha-sd.pdf; Supplier5: tme.pl; Reference5: SD1V107M6L011BB; Manufacturer5: SAMHA; Typ5: SD1V107M6L011BB; Price5: 0,2; DateOfPrice5: 2012-11-24; Price1: 0,15
C2u C3u C4u C5u = CL21B104KBCNNNC[[/\]]0805[[/\]]50V[[/\]]10%[[/\]]100n/50V: as C4c on sheet LPGDetA1_cpu; Value: CL21B104KBCNNNC; Dimensions: 0805; ComponentLink1Description: Datasheet; ComponentLink1URL: http://www.mrq-ml.com/Parts/Capacitors/mlcc_samsung.pdf; Supplier5: tme.pl; Reference5: CL21B104KBCNNNC; Manufacturer5: Samsung; Typ5: CL21B104KBCNNNC; Price5: 0,025; DateOfPrice5: 2013-01-03; Price1: 0,019
C6u C7u C8u C9u = C0805C105K4RAC[[/\]]0805[[/\]]16V[[/\]]10%[[/\]]1u/16V: as C15c on sheet LPGDetA1_cpu; Value: C0805C105K4RAC; Dimensions: 0805; ComponentLink1Description: Datasheet; ComponentLink1URL: http://www.mrq-ml.com/Parts/Capacitors/ceramic_chip_kemet.pdf; Supplier5: tme.pl; Reference5: C0805C105K4RAC; Manufacturer5: KEMET; Typ5: C0805C105K4RAC; Price5: 0,099; DateOfPrice5: 2013-01-03; Price1: 0,099
D1u = 10MQ040N[[/\]]SMA: Descript: Diode type:Schottky; Voltage, Vrrm:40V; Current, If av:1.5A; Voltage, Vf max:0.62V; Case style:SMA; Typ5: 10MQ040NTRPBF; Currency5: PLN; Amount5: 5+; Value: 10MQ040N; Dimensions: SMA; ComponentLink1Description: Datasheet; ComponentLink1URL: http://mrq-ml.com/Parts/Diodes/10mq040n.pdf; Supplier5: tme.pl; Reference5: 10MQ040N; Manufacturer5: Vishay; Price5: 0,5; DateOfPrice5: 2012-11-24; Price1: 0,425
L1u = CAX-0.4-39[[/\]]17.8x12.8x20[[/\]]CAX-0.4-39: Descript: Common mode choke 2x39muH, 0.4A; Amount5: 1+; Currency5: PLN; Value: CAX-0.4-39; OtherParams: CAX-0.4-39; Dimensions: 17.8x12.8x20; ComponentLink1Description: Datasheet; ComponentLink1URL: http://www.mrq-ml.com/Parts/Inductors/Talema_ca_series_.pdf; Supplier5: tme.pl; Reference5: CAX-0.4-39; Manufacturer5: Talema; Typ5: CAX-0.4-39; DateOfPrice5: 2012-12-18; Price5: 4,49; Price1: 3,4900
L2u L3u = BLM31P500SPT[[/\]]1206[[/\]]BLM31P500SPT: Descript: Ferrite bead SMD, 1206, 3A, 0,025ohm; Typ5: BLM31PG500SN1L; Currency5: PLN; Amount5: 100+; Value: BLM31P500SPT; OtherParams: BLM31P500SPT; Dimensions: 1206; ComponentLink1Description: Datasheet; ComponentLink1URL: http://www.mrq-ml.com/Parts/Inductors/Murata_EMI_Suppression_Filters_DC.pdf; Supplier5: tme.pl; Reference5: BLM31P500SPT; Manufacturer5: Murata; Price5: 0,449; DateOfPrice5: 2012-07-17
R1u = 0805WAJ 0R T5E[[/\]]0805[[/\]]0.125W[[/\]]0.1R[[/\]]0R: DissPower: 0.125W; Tolerance: 0.1R; Descript: Resistor 0 ohm, SMD, 0805; Reference5: SMD0805-0R; Currency5: PLN; Amount5: 100+; Value: 0805WAJ 0R T5E; Dimensions: 0805; ComponentLink1Description: Datasheet; ComponentLink1URL: http://www.mrq-ml.com/Parts/Resistors/RoyalOhm_rezystor-smd.pdf; Supplier5: tme.pl; Manufacturer5: Royal Ohm; Typ5: 0805WAJ 0R T5E; Price5: 0,025; DateOfPrice5: 2012-11-24; Price1: 0,025
R2u = 0805WAF 200R T5E[[/\]]0805[[/\]]0.125W[[/\]]1%[[/\]]200R 1%: DissPower: 0.125W; Tolerance: 1%; Descript: Resistor 200ohm, 1%, 0805; Reference5: SMD0805-200R-1%; Currency5: PLN; Amount5: 100+; Value: 0805WAF 200R T5E; Dimensions: 0805; ComponentLink1Description: Datasheet; ComponentLink1URL: http://www.mrq-ml.com/Parts/Resistors/RoyalOhm_rezystor-smd.pdf; Supplier5: tme.pl; Manufacturer5: Royal Ohm; Typ5: 0805WAF 200R T5E; Price5: 0,029; DateOfPrice5: 2012-09-19; Price1: 0,018
R3u = 0805WAF 120R T5E[[/\]]0805[[/\]]0.125W[[/\]]1%[[/\]]120R 1%: as R11c on sheet LPGDetA1_cpu; Value: 0805WAF 120R T5E; Dimensions: 0805; ComponentLink1Description: Datasheet; ComponentLink1URL: http://www.mrq-ml.com/Parts/Resistors/RoyalOhm_rezystor-smd.pdf; Supplier5: tme.pl; Manufacturer5: Royal Ohm; Typ5: 0805WAF 120R T5E; Price5: 0,029; DateOfPrice5: 2012-11-24; Price1: 0,029
U1u = 78M09CDT[[/\]]TO-252: Descript: +9V voltage regulator TO-252, 0.5A; Currency5: PLN; Amount5: 5+; Value: 78M09CDT; Price1: 0,743; Dimensions: TO-252; ComponentLink1Description: Datasheet; ComponentLink1URL: http://www.mrq-ml.com/Parts/ICs/l78m12c.pdf; Supplier5: tme.pl; Reference5: 78M09CDT; Price5: 0,935; DateOfPrice5: 2012-11-24
U2u = L7805ACD2T[[/\]]D2PAK: Descript: Precision voltage regulator 5V/1A D2PAK; Currency5: PLN; Amount5: 3+; Value: L7805ACD2T; Dimensions: D2PAK; ComponentLink1Description: Datasheet; ComponentLink1URL: http://www.mrq-ml.com/Parts/ICs/l7805ac.pdf; Supplier5: tme.pl; Reference5: L7805ACD2T; Manufacturer5: ST; Typ5: L7805ACD2T; Price5: 1,37; DateOfPrice5: 2012-11-24; Price1: 1,09
U3u = MCP1700T3302ETT[[/\]]SOT23-3: Descript: Low quiescent current LDO, 3.3V, 250mA, SOT-23; Typ5: MCP1700T3302E/TT; Currency5: PLN; Amount5: 3+; Value: MCP1700T3302ETT; Price1: 1,2; Dimensions: SOT23-3; ComponentLink1Description: Datasheet; ComponentLink1URL: http://www.mrq-ml.com/Parts/ICs/MCP1700.pdf; Supplier5: tme.pl; Reference5: MCP1700T3302ETT; Manufacturer5: Microchip; Price5: 1,3; DateOfPrice5: 2012-09-20
U4u = ZLDO1117KTC[[/\]]TO-252: Descript: 1A 1.25 to 17V adjustable low drop positive voltage regulator; Reference5: 1825384; Currency5: PLN; Amount5: 1+; Value: ZLDO1117KTC; Price1: 1,91; Dimensions: TO-252; ComponentLink1Description: Datasheet; ComponentLink1URL: http://www.mrq-ml.com/Parts/ICs/ZLDO1117.pdf; Supplier5: farnell.com; Manufacturer5: Diodes Inc.; Typ5: ZLDO1117KTC; Price5: 2,39; DateOfPrice5: 2012-09-19

## Sheet LPGDetA1_out.SchDoc
size A4; DocumentNumber: 5; SheetNumber: 5; SheetTotal: 6; Subtitle0: Zrodlo pradowe w ukladzie Howlanda; LotOfPieces: 1
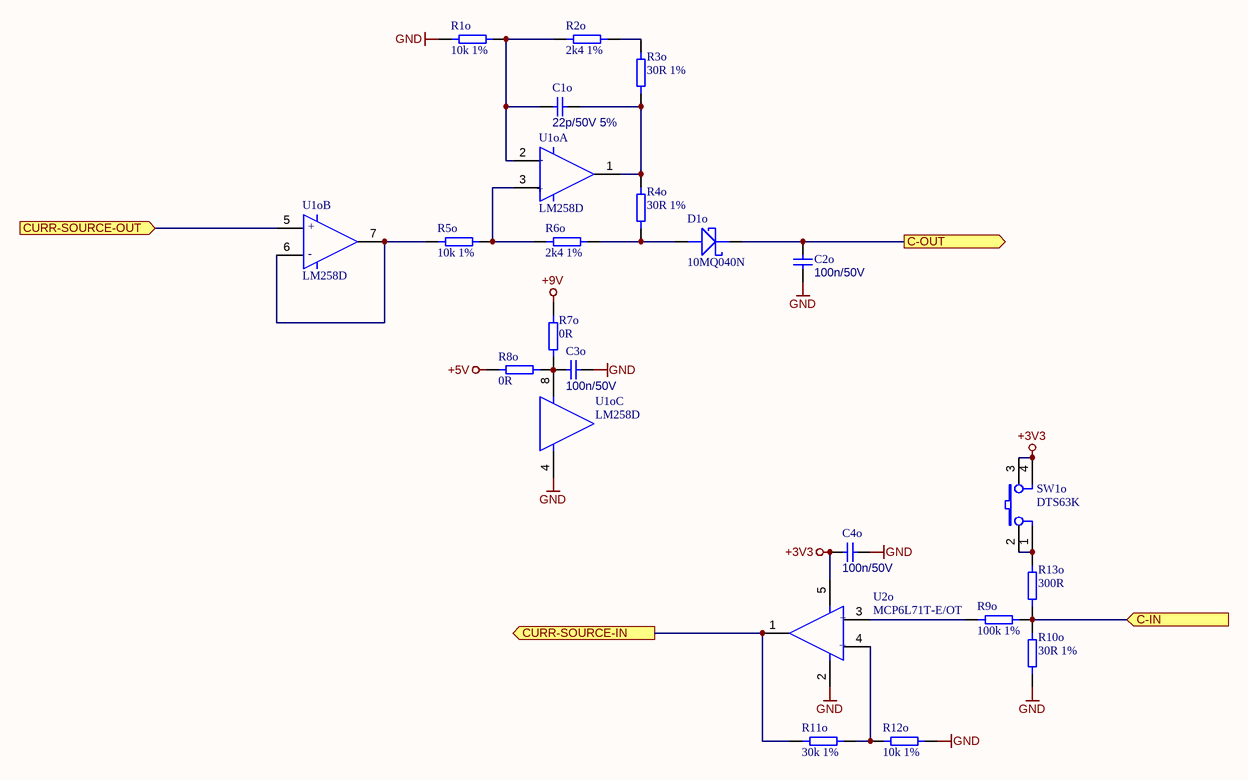
[diagram p3: LPGDetA1_out.SchDoc]

### Parts
(Parts that share a designator on the sheet are numbered #1, #2 ... from top to bottom, then left to right.)
?#4  (no value)
C1o  OtherParams: 22p/50V 5%  [0805]  (hidden comment: CL21C220JBANNNC)
C2o  OtherParams: 100n/50V  [1206_0805]  (hidden comment: CL21B104KBCNNNC)
C3o  OtherParams: 100n/50V  [1206_0805]  (hidden comment: CL21B104KBCNNNC)
C4o  OtherParams: 100n/50V  [1206_0805]  (hidden comment: CL21B104KBCNNNC)
D1o  10MQ040N  [SMA]
R1o  OtherParams: 10k 1%  [0805]  (hidden comment: 0805WAF10KT5E)
R2o  OtherParams: 2k4 1%  [0805]  (hidden comment: 0805WAF 2K4 T5E)
R3o  OtherParams: 30R 1%  [0805]  (hidden comment: 0805WAF 30R T5E)
R4o  OtherParams: 30R 1%  [0805]  (hidden comment: 0805WAF 30R T5E)
R5o  OtherParams: 10k 1%  [0805]  (hidden comment: 0805WAF10KT5E)
R6o  OtherParams: 2k4 1%  [0805]  (hidden comment: 0805WAF 2K4 T5E)
R7o  OtherParams: 0R  [1206_0805]  (hidden comment: 0805WAJ 0R T5E)
R8o  OtherParams: 0R  [1206_0805]  (hidden comment: 0805WAJ 0R T5E)
R9o  OtherParams: 100k 1%  [0805]  (hidden comment: 0805WAF 100K T5E)
R10o  OtherParams: 30R 1%  [0805]  (hidden comment: 0805WAF 30R T5E)
R11o  OtherParams: 30k 1%  [0805]  (hidden comment: 0805WAF 30K T5E)
R12o  OtherParams: 10k 1%  [0805]  (hidden comment: 0805WAF10KT5E)
R13o  OtherParams: 300R  [0805]  (hidden comment: 0805WAJ 300R T5E)
SW1o  DTS63K  [DTS63K]
U1o  LM258D  [8SOIC150]  (parts A,B,C of 3)
U2o  MCP6L71T-E/OT  [SOT23-5]

### Ports
C-IN, C-OUT, CURR-SOURCE-IN, CURR-SOURCE-OUT

### Nets
+3V3: C4o.1 SW1o.3 SW1o.4 U2o.5(PLUS_V)
+5V: R8o.1
+9V: R7o.2
GND: C2o.1 C3o.2 C4o.2 R1o.2 R10o.2 R12o.2 U1o.4(MINUS_V) U2o.2(MINUS_V)
C-IN: R9o.2 R10o.1 R13o.2 ; port C-IN
C-OUT: C2o.2 D1o.CATH ; port C-OUT
CURR-SOURCE-IN: R11o.1 U2o.1(OUTPUT) ; port CURR-SOURCE-IN
CURR-SOURCE-OUT: U1o.5(PLUS_INPUT) ; port CURR-SOURCE-OUT
NetC1o_1: C1o.1 R1o.1 R2o.1 U1o.2(MINUS_INPUT)
NetC1o_2: C1o.2 R3o.1 R4o.2 U1o.1(OUTPUT)
NetC3o_1: C3o.1 R7o.1 R8o.2 U1o.8(PLUS_V)
NetD1o_ANOD: D1o.ANOD R4o.1 R6o.2
NetR2o_2: R2o.2 R3o.2
NetR5o_1: R5o.1 R6o.1 U1o.3(PLUS_INPUT)
NetR5o_2: R5o.2 U1o.6(MINUS_INPUT) U1o.7(OUTPUT)
NetR9o_1: R9o.1 U2o.3(PLUS_INPUT)
NetR11o_2: R11o.2 R12o.1 U2o.4(MINUS_INPUT)
NetR13o_1: R13o.1 SW1o.1 SW1o.2

### Notes on the sheet
- K.A.
- echnology
- Wariant:
- Projekt i wykonanie: Miroslaw Lach MRQ, www.mrq-ml.com
- "AMPROJECT" Andrzej Maciejak
- SVNPath:
- Page:
- Rev.
- /
- File name:
- (in symbol LM258D[[/\]]8SOIC150, part A) -; +
- (in symbol LM258D[[/\]]8SOIC150, part B) +; -
- (in symbol MCP6L71T-E/OT[[/\]]SOT23-5) +; _

### Library data of the parts
?#4 = KATECHNOLOGYLOGO
C1o = CL21C220JBANNNC[[/\]]0805[[/\]]50V[[/\]]5%[[/\]]22p/50V 5%: MaxVoltage: 50V; Tolerance: 5%; Descript: capacitor 22pF, 50V, COG 5%; Currency5: PLN; Amount5: 100+; Value: CL21C220JBANNNC; Dimensions: 0805; ComponentLink1Description: Datasheet; ComponentLink1URL: http://www.mrq-ml.com/Parts/Capacitors/mlcc_samsung.pdf; Supplier5: tme.pl; Reference5: CL21C220JBANNNC; Manufacturer5: Samsung; Typ5: CL21C220JBANNNC; Price5: 0,029; DateOfPrice5: 2012-09-19; Price1: 0,018
C2o C3o C4o = CL21B104KBCNNNC[[/\]]0805[[/\]]50V[[/\]]10%[[/\]]100n/50V: as C4c on sheet LPGDetA1_cpu; Value: CL21B104KBCNNNC; Dimensions: 0805; ComponentLink1Description: Datasheet; ComponentLink1URL: http://www.mrq-ml.com/Parts/Capacitors/mlcc_samsung.pdf; Supplier5: tme.pl; Reference5: CL21B104KBCNNNC; Manufacturer5: Samsung; Typ5: CL21B104KBCNNNC; Price5: 0,025; DateOfPrice5: 2013-01-03; Price1: 0,019
D1o = 10MQ040N[[/\]]SMA: as D1u on sheet LPGDetA1_supply; Value: 10MQ040N; Dimensions: SMA; ComponentLink1Description: Datasheet; ComponentLink1URL: http://mrq-ml.com/Parts/Diodes/10mq040n.pdf; Supplier5: tme.pl; Reference5: 10MQ040N; Manufacturer5: Vishay; Price5: 0,5; DateOfPrice5: 2012-11-24; Price1: 0,425
R1o R5o R12o = 0805WAF10KT5E[[/\]]0805[[/\]]0.125W[[/\]]1%[[/\]]10k 1%: DissPower: 0.125W; Tolerance: 1%; Descript: Resistor 10kohm, 0805, 1%; Reference5: SMD0805-10K-1%; Currency5: PLN; Amount5: 100+; Value: 0805WAF10KT5E; Dimensions: 0805; ComponentLink1Description: Datasheet; ComponentLink1URL: http://www.mrq-ml.com/Parts/Resistors/RoyalOhm_rezystor-smd.pdf; Supplier5: tme.pl; Manufacturer5: Royal Ohm; Typ5: 0805WAF 10K T5E; Price5: 0,029; DateOfPrice5: 2013-01-03; Price1: 0,018
R2o R6o = 0805WAF 2K4 T5E[[/\]]0805[[/\]]0.125W[[/\]]1%[[/\]]2k4 1%: DissPower: 0.125W; Tolerance: 1%; Descript: Resistor 2.4kohm, 1%, 0.125W, 0805; Reference5: SMD0805-2K4-1%; Currency5: PLN; Amount5: 100+; Value: 0805WAF 2K4 T5E; Dimensions: 0805; ComponentLink1Description: Datasheet; ComponentLink1URL: http://www.mrq-ml.com/Parts/Resistors/RoyalOhm_rezystor-smd.pdf; Supplier5: tme.pl; Manufacturer5: Royal Ohm; Typ5: 0805WAF 2K4 T5E; Price5: 0,029; DateOfPrice5: 2012-11-24; Price1: 0,029
R3o R4o R10o = 0805WAF 30R T5E[[/\]]0805[[/\]]0.125W[[/\]]1%[[/\]]30R 1%: as R6c on sheet LPGDetA1_cpu; Value: 0805WAF 30R T5E; Dimensions: 0805; ComponentLink1Description: Datasheet; ComponentLink1URL: http://www.mrq-ml.com/Parts/Resistors/RoyalOhm_rezystor-smd.pdf; Supplier5: tme.pl; Manufacturer5: Royal Ohm; Typ5: 0805WAF 30R T5E; Price5: 0,029; DateOfPrice5: 2012-11-24; Price1: 0,029
R7o R8o = 0805WAJ 0R T5E[[/\]]0805[[/\]]0.125W[[/\]]0.1R[[/\]]0R: as R1u on sheet LPGDetA1_supply; Value: 0805WAJ 0R T5E; Dimensions: 0805; ComponentLink1Description: Datasheet; ComponentLink1URL: http://www.mrq-ml.com/Parts/Resistors/RoyalOhm_rezystor-smd.pdf; Supplier5: tme.pl; Manufacturer5: Royal Ohm; Typ5: 0805WAJ 0R T5E; Price5: 0,025; DateOfPrice5: 2012-11-24; Price1: 0,025
R9o = 0805WAF 100K T5E[[/\]]0805[[/\]]0.125W[[/\]]1%[[/\]]100k 1%: DissPower: 0.125W; Tolerance: 1%; Descript: Resistor 100kohm, 0805, 1%; Reference5: SMD0805-100K-1%; Currency5: PLN; Amount5: 100+; Value: 0805WAF 100K T5E; Dimensions: 0805; ComponentLink1Description: Datasheet; ComponentLink1URL: http://www.mrq-ml.com/Parts/Resistors/RoyalOhm_rezystor-smd.pdf; Supplier5: tme.pl; Manufacturer5: Royal Ohm; Typ5: 0805WAF 100K T5E; Price5: 0,029; DateOfPrice5: 2012-09-20; Price1: 0,017
R11o = 0805WAF 30K T5E[[/\]]0805[[/\]]0.125W[[/\]]1%[[/\]]30k 1%: DissPower: 0.125W; Tolerance: 1%; Descript: Resistor 30kohm, 0805, 1%; Reference5: SMD0805-30K-1%; Currency5: PLN; Amount5: 100+; Value: 0805WAF 30K T5E; Dimensions: 0805; ComponentLink1Description: Datasheet; ComponentLink1URL: http://www.mrq-ml.com/Parts/Resistors/RoyalOhm_rezystor-smd.pdf; Supplier5: tme.pl; Manufacturer5: Royal Ohm; Typ5: 0805WAF 30K T5E; Price5: 0,029; DateOfPrice5: 2012-11-24; Price1: 0,029
R13o = 0805WAJ 300R T5E[[/\]]0805[[/\]]0.125W[[/\]]5%[[/\]]300R: DissPower: 0.125W; Tolerance: 5%; Descript: Rezystor:thick film; SMD; 0805; 300R; 0,125W; ±5%; -55÷125°C; Reference5: SMD0805-300R; Currency5: PLN; Amount5: 100+; Value: 0805WAJ 300R T5E; Dimensions: 0805; ComponentLink1Description: Datasheet; ComponentLink1URL: http://www.mrq-ml.com/Parts/Resistors/RoyalOhm_rezystor-smd.pdf; Supplier5: tme.pl; Manufacturer5: Royal Ohm; Typ5: 0805WAJ 300R T5E; Price5: 0,025; DateOfPrice5: 2012-09-18; Price1: 0,01
SW1o = DTS63K[[/\]]DTS63K[[/\]]6x6: Descript: tactile switch; Typ5: DTS-63K; Currency5: PLN; Amount5: 5+; Value: DTS63K; OtherParams: DTS63K; Dimensions: 6x6; ComponentLink1Description: Datasheet; ComponentLink1URL: http://www.mrq-ml.com/Parts/Electromechanical/DTSxA62x6xx644.pdf; Supplier5: tme.pl; Reference5: DTS63K; Manufacturer5: Diptronics; Price5: 0,5655; DateOfPrice5: 2012-09-21
U1o = LM258D[[/\]]8SOIC150: Descript: Low Power Dual Operational Amplifiers; Reference5: LM258DSMD; Currency5: PLN; Amount5: 10+; Value: LM258D; Dimensions: 8SOIC150; ComponentLink1Description: Datasheet; ComponentLink1URL: http://www.mrq-ml.com/Parts/ICs/LM158.pdf; Supplier5: tme.pl; Price5: 0,397; DateOfPrice5: 2012-11-16; Price1: 0,305; Manufacturer5: Texas Instruments; Typ5: LM258D
U2o = MCP6L71T-E/OT[[/\]]SOT23-5: Descript: 2MHz, 85uA, OpAmp, SOT23-5; Reference5: 1715861; Currency5: PLN; Amount5: 1+; Value: MCP6L71T-E/OT; Price1: 1,33; Dimensions: SOT23-5; ComponentLink1Description: Datasheet; ComponentLink1URL: http://www.mrq-ml.com/Parts/ICs/MCP6L71.pdf; Supplier5: farnell.com; Manufacturer5: Microchip; Typ5: MCP6L71T-E/OT; Price5: 1,86; DateOfPrice5: 2012-11-03